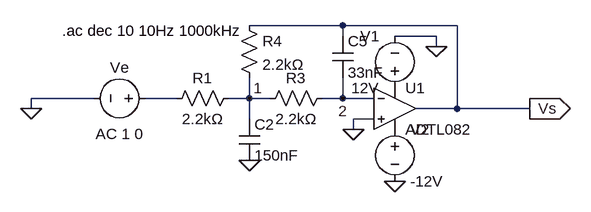
[diagram p0: schematic passe-bas.asc]
passe-bas.asc, the LTspice schematic file:
Version 4
SHEET 1 880 680
WIRE 128 48 -16 48
WIRE 304 48 128 48
WIRE 128 64 128 48
WIRE 272 64 208 64
WIRE 272 80 272 64
WIRE -256 160 -352 160
WIRE -128 160 -176 160
WIRE -16 160 -16 128
WIRE -16 160 -48 160
WIRE 16 160 -16 160
WIRE 128 160 128 128
WIRE 128 160 96 160
WIRE 176 160 128 160
WIRE -352 176 -352 160
WIRE 304 176 304 48
WIRE 304 176 240 176
WIRE 416 176 304 176
WIRE -16 192 -16 160
WIRE 176 192 144 192
WIRE 144 208 144 192
FLAG 144 208 0
FLAG -16 160 1
FLAG 128 160 2
FLAG -352 176 0
FLAG -16 256 0
FLAG 416 176 Vs
IOPIN 416 176 Out
FLAG 272 80 0
FLAG 208 288 0
SYMBOL OpAmps\\ADTL082 208 112 R0
SYMATTR InstName U1
SYMBOL voltage -160 160 R90
WINDOW 0 -32 56 VBottom 2
WINDOW 3 32 56 VTop 2
WINDOW 123 39 56 VTop 2
WINDOW 39 0 0 Left 0
SYMATTR InstName Ve
SYMATTR Value ""
SYMATTR Value2 AC 1 0
SYMBOL res -32 32 R0
SYMATTR InstName R4
SYMATTR Value 2.2kΩ
SYMBOL cap 112 64 R0
SYMATTR InstName C5
SYMATTR Value 33nF
SYMBOL cap -32 192 R0
SYMATTR InstName C2
SYMATTR Value 150nF
SYMBOL res -32 144 R90
WINDOW 0 0 56 VBottom 2
WINDOW 3 32 56 VTop 2
SYMATTR InstName R1
SYMATTR Value 2.2kΩ
SYMBOL res 112 144 R90
WINDOW 0 0 56 VBottom 2
WINDOW 3 32 56 VTop 2
SYMATTR InstName R3
SYMATTR Value 2.2kΩ
SYMBOL voltage 208 160 R180
WINDOW 0 24 96 Left 2
WINDOW 3 24 16 Left 2
WINDOW 123 0 0 Left 0
WINDOW 39 0 0 Left 0
SYMATTR InstName V1
SYMATTR Value 12V
SYMBOL voltage 208 192 R0
WINDOW 123 0 0 Left 0
WINDOW 39 0 0 Left 0
SYMATTR InstName V2
SYMATTR Value -12V
TEXT -304 56 Left 2 !.ac dec 10 10Hz 1000kHz

The netlist it stands for:
* passe-bas.asc
XU1 0 2 P001 P002 Vs ADTL082  ; pins In+ In- V+ V- OUT
Ve N001 0 AC 1 0
R4 Vs 1 2.2kΩ
C5 Vs 2 33nF
C2 1 0 150nF
R1 1 N001 2.2kΩ
R3 2 1 2.2kΩ
V1 P001 0 12V
V2 P002 0 -12V
.ac dec 10 10Hz 1000kHz
.lib ADI.lib
.backanno
.end

* Results of the author's LTspice run, read from the files saved beside the schematic
* Operating Point, zero values left out:
*   V(p001) = 12 V
*   V(vs) = 13.2 nV
*   V(p002) = -12 V
*   I(R3) = -2 pA
*   I(R1) = 2 pA
*   I(R4) = 4 pA
*   I(V2) = 5.055 mA
*   I(V1) = -5.055 mA
*   I(Ve) = 2 pA
*   Ix(u1:1) = 2 pA
*   Ix(u1:2) = 2 pA
*   Ix(u1:3) = 5.055 mA
*   Ix(u1:4) = -5.055 mA
*   Ix(u1:5) = -4 pA
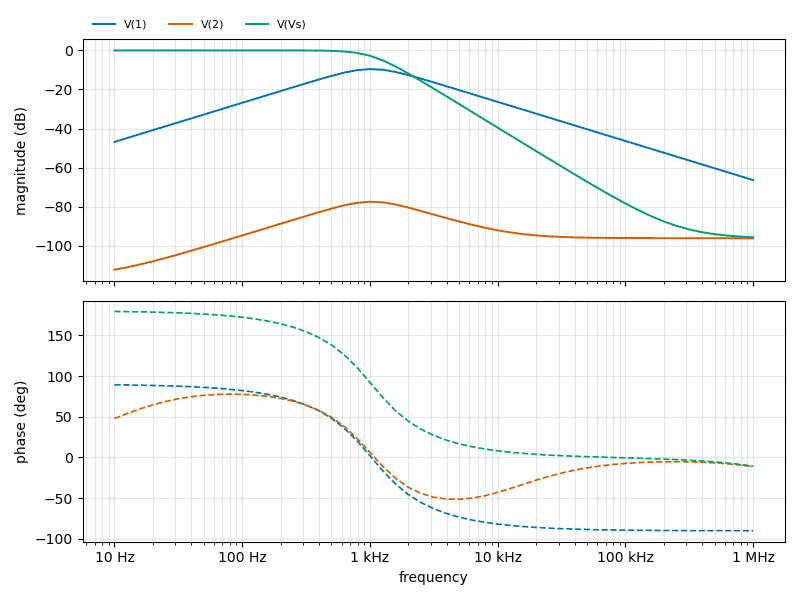
[diagram p1: AC Analysis of passe-bas.asc, plotted from the saved traces]
* AC Analysis, 1 run:
*   V(1): -46.81 dB at 10 Hz, -66.33 dB at 1 MHz, peak -9.55 dB at 1 kHz, 3 dB below the peak at 535.2 Hz and 1.981 kHz
*   V(2): -112.20 dB at 10 Hz, -96.20 dB at 1 MHz, peak -77.41 dB at 1 kHz, 3 dB below the peak at 536.6 Hz and 2.004 kHz
*   V(Vs): -0.00 dB at 10 Hz, -95.63 dB at 1 MHz, peak 0.00 dB at 100 Hz, 3 dB below the peak at 1.028 kHz